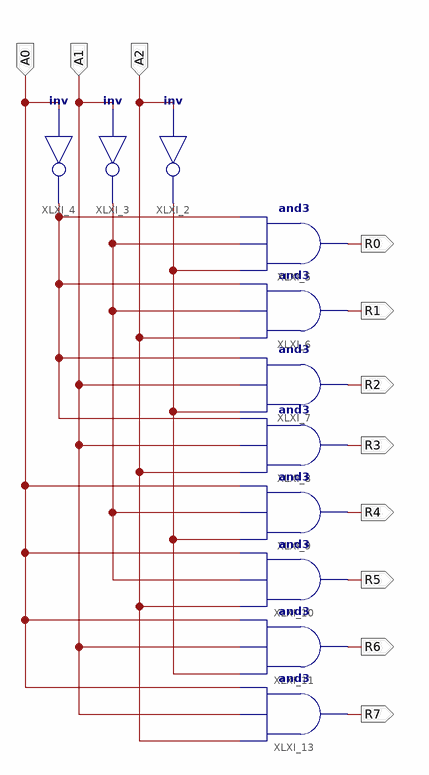
[diagram p0: schematic sheet 1]
// Xilinx ISE schematic register_file.sch (spartan3e) as structural Verilog: 11 symbols, 11 ports
module register_file (
  input  A0,
  input  A1,
  input  A2,
  output R0,
  output R1,
  output R2,
  output R3,
  output R4,
  output R5,
  output R6,
  output R7
);

  wire XLXN_26, XLXN_49, XLXN_52;

  not XLXI_2 (XLXN_52, A2);
  not XLXI_3 (XLXN_49, A1);
  not XLXI_4 (XLXN_26, A0);
  and XLXI_13 (R7, A2, A1, A0);
  and XLXI_6 (R1, A2, XLXN_49, XLXN_26);
  and XLXI_7 (R2, XLXN_52, A1, XLXN_26);
  and XLXI_8 (R3, A2, A1, XLXN_26);
  and XLXI_9 (R4, XLXN_52, XLXN_49, A0);
  and XLXI_10 (R5, A2, XLXN_49, A0);
  and XLXI_11 (R6, XLXN_52, A1, A0);
  and XLXI_5 (R0, XLXN_52, XLXN_49, XLXN_26);
endmodule
